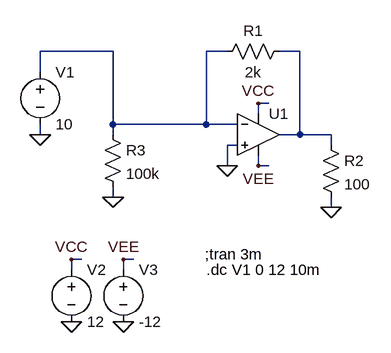
[diagram p0: schematic 3320_FCV_Max.asc]
3320_FCV_Max.asc, the LTspice schematic file:
Version 4
SHEET 1 880 680
WIRE 16 32 -96 32
WIRE 192 32 160 32
WIRE 304 32 272 32
WIRE -96 64 -96 32
WIRE 256 112 240 112
WIRE 240 128 240 112
WIRE 16 144 16 32
WIRE 160 144 160 32
WIRE 160 144 16 144
WIRE 208 144 160 144
WIRE -96 160 -96 144
WIRE 16 160 16 144
WIRE 304 160 304 32
WIRE 304 160 272 160
WIRE 352 160 304 160
WIRE 208 176 192 176
WIRE 352 176 352 160
WIRE 192 208 192 176
WIRE 192 208 176 208
WIRE 240 208 240 192
WIRE 256 208 240 208
WIRE 16 256 16 240
WIRE 352 272 352 256
WIRE -32 352 -48 352
WIRE 48 352 32 352
WIRE -48 368 -48 352
WIRE 32 368 32 352
FLAG 240 112 VCC
FLAG 240 208 VEE
FLAG 192 208 0
FLAG 16 256 0
FLAG -96 160 0
FLAG 352 272 0
FLAG -48 448 0
FLAG 32 448 0
FLAG -48 352 VCC
FLAG 32 352 VEE
SYMBOL Opamps\\UniversalOpamp2 240 160 R0
SYMATTR InstName U1
SYMBOL res 288 16 R90
WINDOW 0 0 56 VBottom 2
WINDOW 3 32 56 VTop 2
SYMATTR InstName R1
SYMATTR Value 2k
SYMBOL res 336 160 R0
SYMATTR InstName R2
SYMATTR Value 100
SYMBOL voltage -96 48 R0
SYMATTR InstName V1
SYMATTR Value 10
SYMBOL voltage -48 352 R0
WINDOW 123 0 0 Left 0
WINDOW 39 0 0 Left 0
SYMATTR InstName V2
SYMATTR Value 12
SYMBOL voltage 32 352 R0
WINDOW 123 0 0 Left 0
WINDOW 39 0 0 Left 0
SYMATTR InstName V3
SYMATTR Value -12
SYMBOL res 0 144 R0
SYMATTR InstName R3
SYMATTR Value 100k
TEXT 158 344 Left 2 !;tran 3m
TEXT 160 368 Left 2 !.dc V1 0 12 10m

The netlist it stands for:
* 3320_FCV_Max.asc
XU1 0 N001 VCC VEE N002 level.2 Avol=1Meg GBW=10Meg Slew=10Meg ilimit=25m rail=0 Vos=0 phimargin=45 en=0 enk=0 in=0 ink=0 Rin=500Meg  ; pins IN+ IN- V+ V- OUT
R1 N002 N001 2k
R2 N002 0 100
V1 N001 0 10
V2 VCC 0 12
V3 VEE 0 -12
R3 N001 0 100k
;tran 3m
.dc V1 0 12 10m
.lib UniversalOpamps2.sub
.backanno
.end